# EAGLE design ICS40300-preamp-surfacemount_Rev-B (EAGLE 8.1.0)
COMPANY: ADAFRUIT INDUSTRIES; DRAWN: KTOWN; REV: A
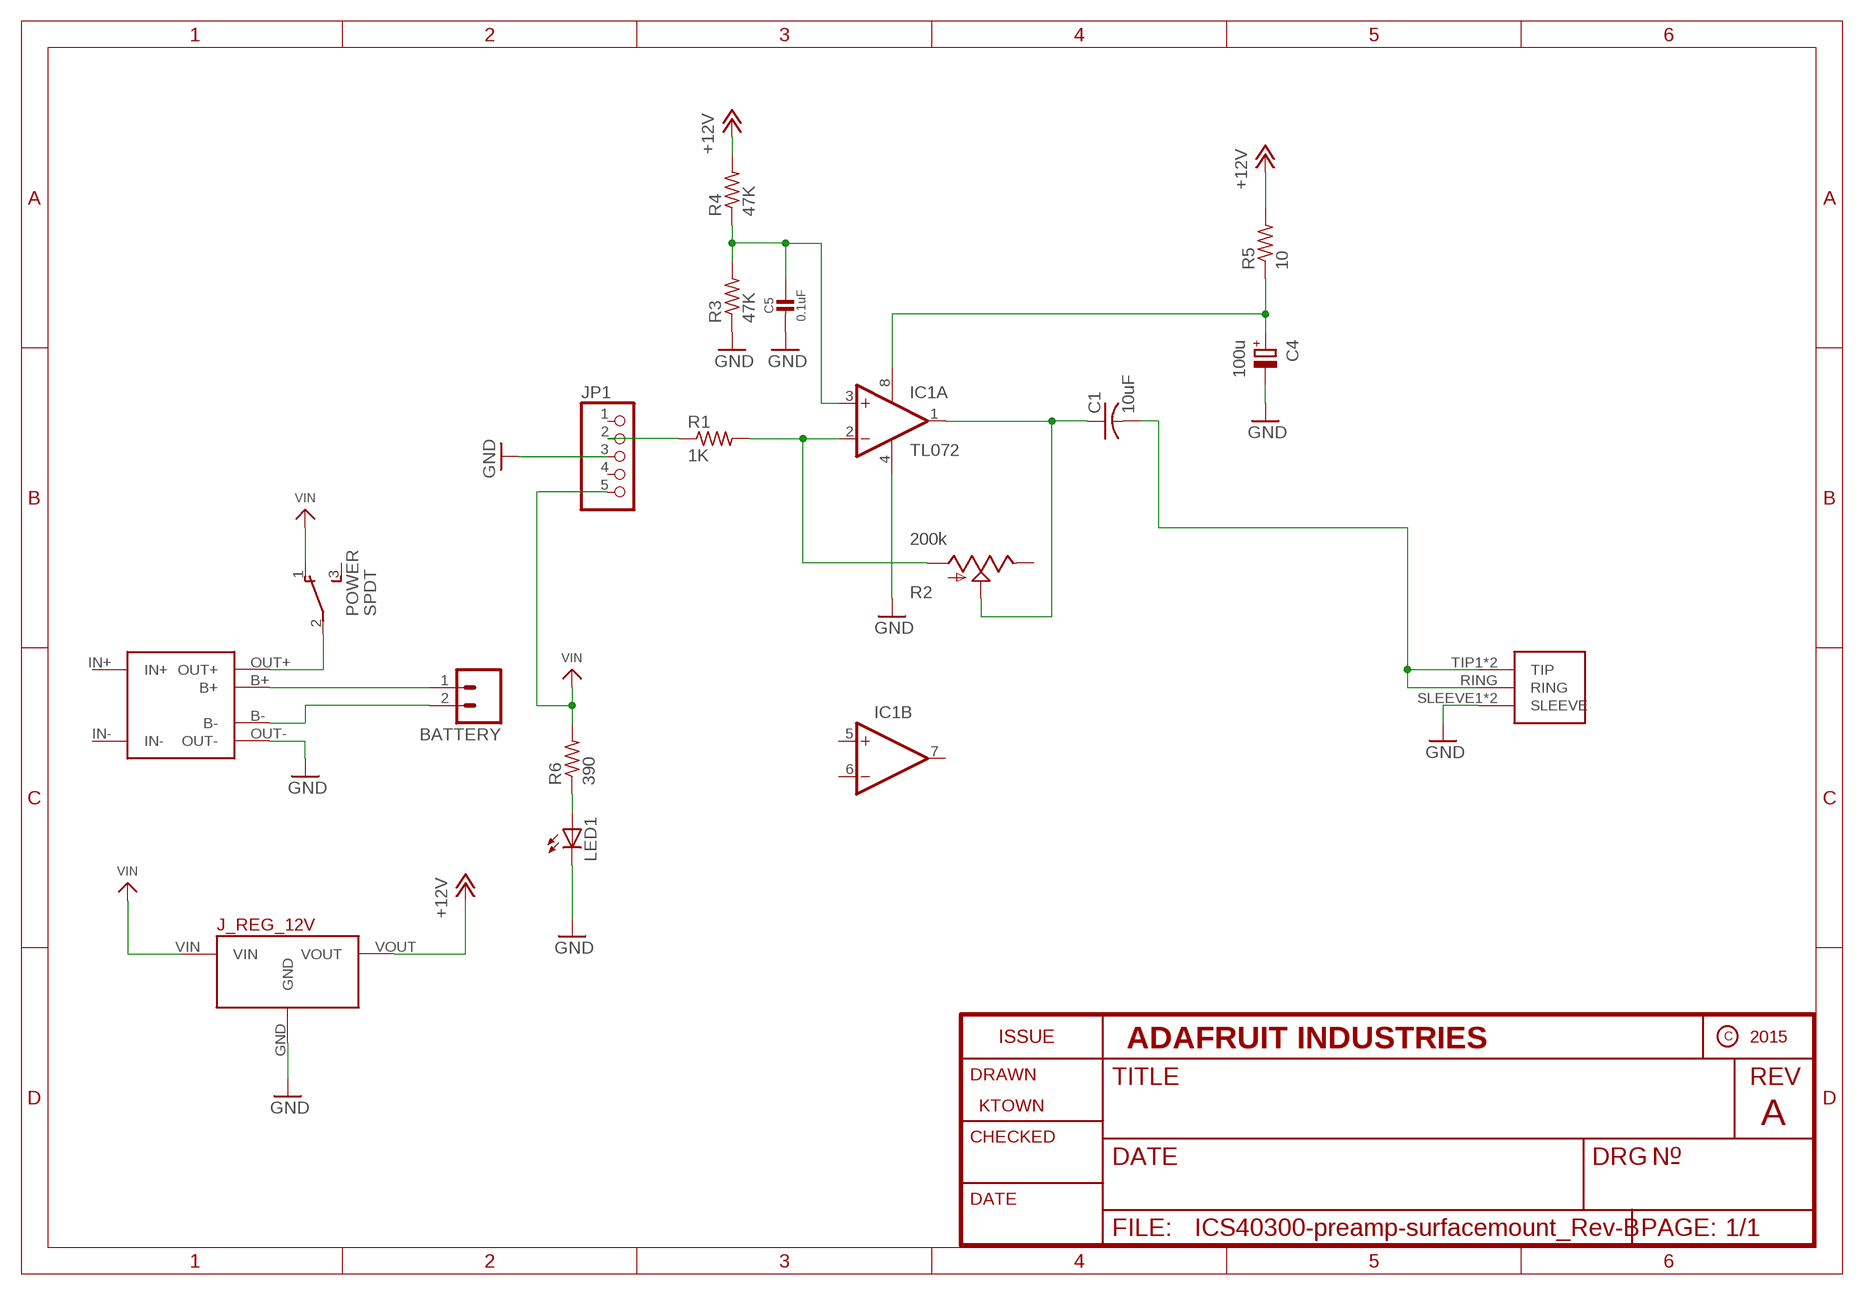
[diagram p0: schematic, sheet 1]

## Parts
BATTERY  M02LOCK  [1X02_LOCK]
C1  10uF  C-USC0805K  [C0805K]
C4  100u  CPOL-EUTT2D4L  [TT2D4L]
C5  0.1uF  CAP_CERAMIC0805-NOOUTLINE  [0805-NO]
IC1  TL072  OPA2134UA  [SO08]
J_REG_12V  POLOLU_VOLTAGE_REGULATORS_3PIN  [POLOLU_5V-12V_STEPUP_U3V12F5-U3V12F12]
JP1  HEADER-1X576MIL  [1X05_ROUND_76]
LED1  LED3MM  [LED3MM]
POWER  SPDT  SWITCH_SPDTTE-CONNECT  [SWITCH_SPDT-TE-CONNECT]
R1  1K  R-US_R0805  [R0805]
R2  200k  TRIMPOT-BOURNS3306W  [TRIMPOT-BOURNS-3306W]
R3  47K  R-US_R0805  [R0805]
R4  47K  R-US_R0805  [R0805]
R5  10  R-US_R0805  [R0805]
R6  390  R-US_R0805  [R0805]
U$1  TP4056-MODULETP4056  [TP4056-LITHIUM-PROTECTED-MODULE-MOVED-PAD]
U$13  1/8"-F-STEREO-PCB  [1/8"-F-STEREO-PCB]

## Nets
+12V: J_REG_12V.VOUT R4.2 R5.2
GND: C4.- C5.2 IC1.4(A:V-) J_REG_12V.GND JP1.3 LED1.K(C) R3.1 U$1.OUT- U$13.SLEEVE1(SLEEVE) U$13.SLEEVE2(SLEEVE)
N$1: JP1.2 R1.1
N$2: IC1.2(A:-IN) R1.2 R2.P$1(IN)
N$3: POWER.2 U$1.OUT+
N$4: C4.+ IC1.8(A:V+) R5.1
N$5: BATTERY.1 U$1.B+
N$6: BATTERY.2 U$1.B-
N$7: C1.2 U$13.RING U$13.TIP1(TIP) U$13.TIP2(TIP)
N$8: C5.1 IC1.3(A:+IN) R3.2 R4.1
N$9: C1.1 IC1.1(A:OUT) R2.P$2(WIPER)
N$16: LED1.A R6.1
VIN: J_REG_12V.VIN JP1.5 POWER.1 R6.2
Unconnected: IC1.5(B:+IN) IC1.6(B:-IN) IC1.7(B:OUT) JP1.1 JP1.4 POWER.3 R2.P$3(OUT)

## Power pins joined to a net without a drawn wire
IN+: U$1.IN+
IN-: U$1.IN-

## Library data of the parts
BATTERY = CMU-ArtFab:M02: Header 2 Standard 2-pin 0.1" header. Use with straight break away headers (SKU : PRT-00116), right angle break away headers (PRT-00553), swiss pins (PRT-00743), machine pins (PRT-00117), and female headers (PRT-00115). Molex polarized connector foot print use with SKU : PRT-08233 with associated crimp pins and housings.
C1 = rcl:C-US: CAPACITOR, American symbol
C4 = rcl:CPOL-EU: POLARIZED CAPACITOR, European symbol
C5 = microbuilder:CAP_CERAMIC: Ceramic Capacitors For new designs, use the packages preceded by an '_' character since they are more reliable: The following footprints should be used on most boards: _0402 - Standard footprint for regular board layouts _0603 - Standard footprint for regular board layouts _0805 - Standard footprint for regular board layouts _1206 - Standard footprint for regular board layouts For extremely tight-pitch boards where space is at a premium, the following 'micro-pitch' footprints can be used (smaller pads, no silkscreen outline, etc.): _0402MP - Micro-pitch footprint for very dense/compact boards _0603MP - Micro-pitch footprint for very dense/compact boards _0805MP - Micro-pitch footprint for very dense/compact boards _1206MP - Micro-pitch footprint for very dense/compact boards
IC1 = linear:OPA2*: Dual Operational Amplifier Low Power, Single-Supply, Rail-To-Rail Operational Amplifier Source: http://focus.ti.com/lit/ds/symlink/opa2345.pdf http://focus.ti.com .. opa241.pdf http://focus.ti.com/lit/ds/symlink/opa2134.pdf; IC_NAME: TL072
J_REG_12V = CMU-ArtFab:POLOLU_VOLTAGE_REGULATORS_3PIN: Polulu 5V Step-Up/Step-Down Voltage REgulator S7V7F5
JP1 = microbuilder:HEADER-1X5: PIN HEADER
LED1 = led:LED: LED OSRAM: - CHIPLED LG R971, LG N971, LY N971, LG Q971, LY Q971, LO R971, LY R971 LH N974, LH R974 LS Q976, LO Q976, LY Q976 LO Q996 - Hyper CHIPLED LW Q18S LB Q993, LB Q99A, LB R99A - SideLED LS A670, LO A670, LY A670, LG A670, LP A670 LB A673, LV A673, LT A673, LW A673 LH A674 LY A675 LS A676, LA A676, LO A676, LY A676, LW A676 LS A679, LY A679, LG A679 - Hyper Micro SIDELED® LS Y876, LA Y876, LO Y876, LY Y876 LT Y87S - SmartLED LW L88C, LW L88S LB L89C, LB L89S, LG L890 LS L89K, LO L89K, LY L89K LS L896, LA L896, LO L896, LY L896 - TOPLED LS T670, LO T670, LY T670, LG T670, LP T670 LSG T670, LSP T670, LSY T670, LOP T670, LYG T670 LG T671, LOG T671, LSG T671 LB T673, LV T673, LT T673, LW T673 LH T674 LS T676, LA T676, LO T676, LY T676, LB T676, LH T676, LSB T676, LW T676 LB T67C, LV T67C, LT T67C, LS T67K, LO T67K, LY T67K, LW E67C LS E67B, LA E67B, LO E67B, LY E67B, LB E67C, LV E67C, LT E67C LW T67C LS T679, LY T679, LG T679 LS T770, LO T770, LY T770, LG T770, LP T770 LB T773, LV T773, LT T773, LW T773 LH T774 LS E675, LA E675, LY E675, LS T675 LS T776, LA T776, LO T776, LY T776, LB T776 LHGB T686 LT T68C, LB T68C - Hyper Mini TOPLED® LB M676 - Mini TOPLED Santana® LG M470 LS M47K, LO M47K, LY M47K Source: http://www.osram.convergy.de LUXEON: - LUMILED® LXK2-PW12-R00, LXK2-PW12-S00, LXK2-PW14-U00, LXK2-PW14-V00 LXK2-PM12-R00, LXK2-PM12-S00, LXK2-PM14-U00 LXK2-PE12-Q00, LXK2-PE12-R00, LXK2-PE12-S00, LXK2-PE14-T00, LXK2-PE14-U00 LXK2-PB12-K00, LXK2-PB12-L00, LXK2-PB12-M00, LXK2-PB14-N00, LXK2-PB14-P00, LXK2-PB14-Q00 LXK2-PR12-L00, LXK2-PR12-M00, LXK2-PR14-Q00, LXK2-PR14-R00 LXK2-PD12-Q00, LXK2-PD12-R00, LXK2-PD12-S00 LXK2-PH12-R00, LXK2-PH12-S00 LXK2-PL12-P00, LXK2-PL12-Q00, LXK2-PL12-R00 Source: www.luxeon.com KINGBRIGHT: KA-3528ASYC Source: www.kingbright.com
POWER = CMU-ArtFab:SWITCH_SPDT
R1 R3-R6 = CMU-ArtFab:R-US_: RESISTOR, American symbol
R2 = CMU-ArtFab:TRIMPOT-BOURNS
U$1 = CMU-ArtFab:TP4056-MODULE
U$13 = CMU-ArtFab:1/8"-F-STEREO-PCB

## Board
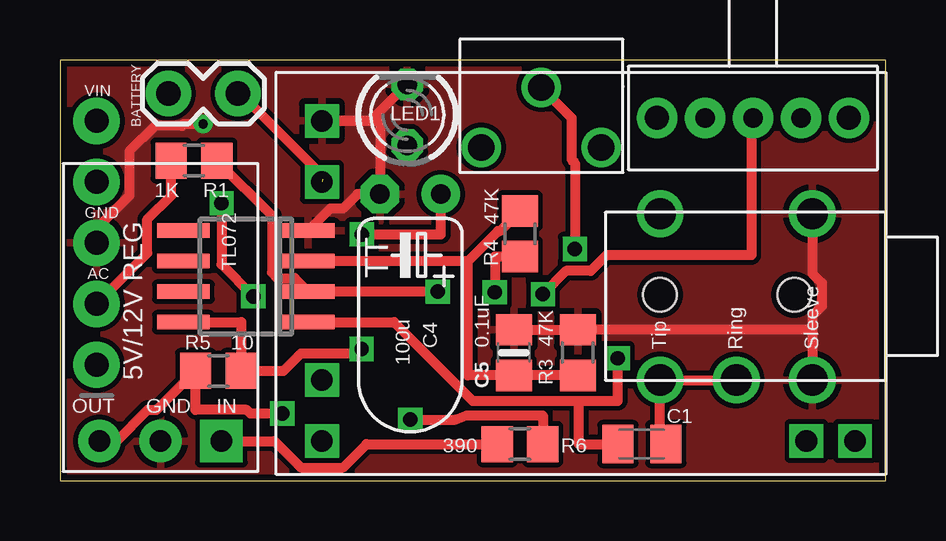
[diagram p1: board, top side]
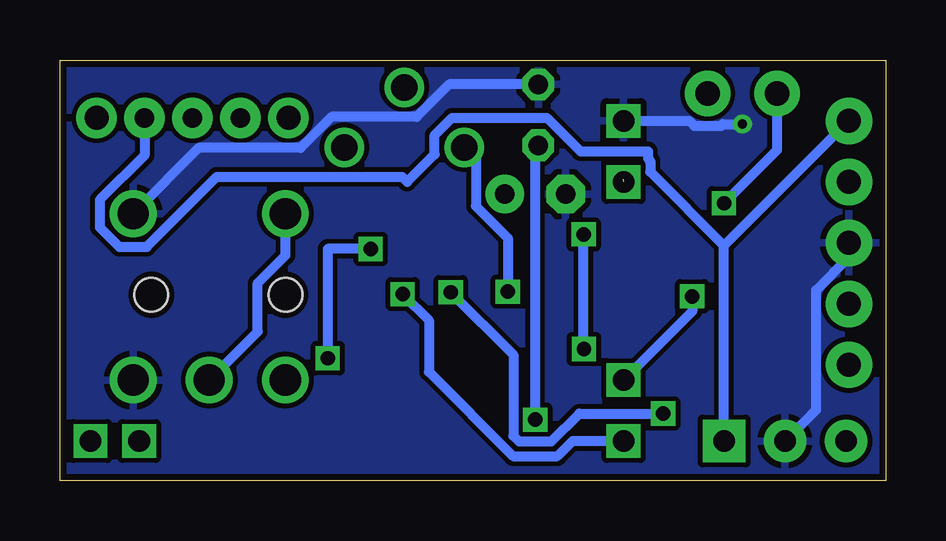
[diagram p2: board, bottom side, seen from below]

Size 34.42 x 17.53 mm. Coordinates in mm from the lower left corner, seen from the top.
Outline: 0,0 34.42,0 34.42,17.53 0,17.53 0,0
Copper layers (1*16): Top 0.035mm / dielectric 1.5mm / Bottom 0.035mm
Design rules "adafruit *": minimum track width 12mil, minimum drill 15.5mil, track to track 8mil, track to pad 8mil, pad to pad 8mil, via to via 8mil, smd to smd 8mil, copper to edge 10mil, drill to drill 8mil, minimum pad ring 10mil, minimum via ring 8mil, stop-mask expansion 2mil, vias tented up to drill 20mil, thermal gap 10mil

### Footprints (pad centres in the part's own frame; a part is rotated, then mirrored left to right if it is on the bottom)
1X02_LOCK = drill 1.016 pad 1.88: 1 -0.178,0; 2 2.718,0
C0805K = smd 1.3 x 1.6: 1 -1,0; 2 1,0
TT2D4L = drill 0.813 pad 1.6: + -1.27,0 | drill 0.813 pad 1.6 octagon: - 1.27,0
0805-NO = smd 1.3 x 1.5: 1 -0.95,0; 2 0.95,0
SO08 = smd 0.6 x 2.2: 1 -1.905,-2.6; 2 -0.635,-2.6; 3 0.635,-2.6; 4 1.905,-2.6; 5 1.905,2.6; 6 0.635,2.6; 7 -0.635,2.6; 8 -1.905,2.6
POLOLU_5V-12V_STEPUP_U3V12F5-U3V12F12 = drill 0.9 pad 1.778: GND 0,-6.35; VOUT -2.54,-6.35 | drill 0.9 pad 1.778 square: VIN 2.54,-6.35
1X05_ROUND_76 = drill 1 pad 1.93: 1 -5.08,0; 2 -2.54,0; 3 0,0; 4 2.54,0; 5 5.08,0
LED3MM = drill 0.813 octagon: A -1.27,0; K 1.27,0
SWITCH_SPDT-TE-CONNECT = drill 0.8 pad 1.676: 1 2,0; 2 4,0; 3 6,0 | drill 1 pad 1.676: MOUNT1 0,0; MOUNT2 8,0
R0805 = smd 1.3 x 1.5: 1 -0.95,0; 2 0.95,0
TRIMPOT-BOURNS-3306W = drill 1.1: P$1 -2.505,-2.495; P$2 -0.005,0.005; P$3 2.495,-2.495
TP4056-LITHIUM-PROTECTED-MODULE-MOVED-PAD = drill 0.9 square: B+ 10.795,4.445; B- 10.795,-3.81; IN+ -11.43,6.985; IN- -9.398,6.985; OUT+ 10.795,6.985; OUT- 10.795,-6.35
1/8"-F-STEREO-PCB = drill 1.3: RING 5.461,0; SLEEVE1 8.636,6.934; SLEEVE2 8.636,0; TIP1 2.286,6.934; TIP2 2.286,0 | hole 1.4: 2.286,3.556; 7.874,3.556

### Placement (x,y rotation side)
BATTERY  4.7,16.13 0 top
C1  24.26,1.52 0 top
C4  14.61,11.94 180 top
C5  18.92,5.33 90 top
IC1  7.75,8.51 90 top
J_REG_12V  4.19,8 0 top
JP1  1.52,9.91 90 top
LED1  14.48,15.24 90 top
POWER  32.89,15.11 180 top
R1  5.59,13.34 0 top
R2  20.07,16.38 0 top
R3  21.59,5.33 270 top
R4  19.18,10.29 270 top
R5  6.6,4.57 180 top
R6  19.18,1.52 180 top
U$1  21.72,8.64 180 top
U$13  22.73,4.19 0 top

### Tracks (layer width: path | path; a pad name or v marks a point on that pad's centre or on a via)
+12V  (via drill 0.6)
  Top 0.406: J_REG_12V.VOUT 2.36,1.65 3.65,2.95 4.03,2.95 R5.2 5.65,2.95 7.79,2.95 7.94,2.79 v9.27,2.79 | R4.2 18.13,9.34 v18.13,7.85
  Bottom 0.406: v18.13,7.85 15.52,5.24 15.52,1.87 15.28,1.63 13.93,1.63 12.77,2.79 v9.27,2.79
GND  (via drill 0.38)
  Top 0.406: C5.2 R3.1 31.37,6.28 | 31.37,6.28 U$13.SLEEVE2 | U$13.SLEEVE1 31.37,8.62 31.76,8.23 31.76,7.27 31.37,6.87 31.37,6.28 | LED1.K 12.95,14.99 U$1.OUT- 13.34,14.99 C4.- 12.4,11.94 11.79,11.34 11.27,11.34 IC1.4 | v5.97,14.86 5.16,14.86 5.08,14.78 3.96,14.78 2.9,13.71 2.9,11.88 1.52,10.51 JP1.3
  Bottom 0.406: JP1.3 1.52,9.31 2.9,7.93 2.9,2.95 J_REG_12V.GND | LED1.K 18.2,16.51 19.55,15.16 23.09,15.16 24.38,13.87 28.63,13.87 U$13.SLEEVE1 | U$1.OUT- 8.18,14.99 7.97,14.78 6.86,14.78 6.78,14.86 v5.97,14.86
  pour Top: 34.8,-0.76 34.8,18.29 -0.25,18.29 -0.25,-0.76
  pour Bottom: -0.25,-0.76 34.8,-0.76 34.8,18.29 -0.25,18.29
N$1
  Top 0.406: R1.1 4.64,11.88 3.64,10.88 3.64,9.48 JP1.2
N$2  (via drill 0.6)
  Top 0.406: R1.2 8.84,11.03 8.84,8.68 9.08,8.44 9.78,8.44 IC1.2 v15.75,7.87
  Bottom 0.406: v15.75,7.87 15.75,10.11 17.08,11.44 17.08,13.41 R2.P$1
N$3  (via drill 0.6)
  Top 0.406: POWER.2 28.83,15.11 28.83,9.4 22.79,9.4 22.14,8.74 21.1,8.74 v20.13,7.77
  Bottom 0.406: v20.13,7.77 19.04,6.68 19.04,4.53 15.53,1.02 13.68,1.02 13.05,1.65 U$1.OUT+
N$4  (via drill 0.6)
  Top 0.406: v12.57,5.49 12.39,5.3 10.05,5.3 9.32,4.57 R5.1 7.55,6.6 IC1.8 | v12.59,10.26 15.88,10.26 C4.+
  Bottom 0.406: v12.57,5.49 12.59,5.49 v12.59,10.26
N$5  (via drill 0.6)
  Top 0.406: v6.73,11.56 6.73,9.01 v8.06,7.68
  Bottom 0.406: BATTERY.1 4.52,13.77 v6.73,11.56 | v8.06,7.68 8.06,7.05 U$1.B+
N$6  (1 unrouted)
  Top 0.406: 10.96,12.55 10.96,12.7 7.53,16.13 BATTERY.2
N$7
  Top 0.406: U$13.RING U$13.TIP2 25.02,1.52 C1.2
  Bottom 0.406: U$13.TIP1 25.02,9.38 26.18,8.23 26.18,6.21 U$13.RING
N$8
  Top 0.406: 17.01,9.14 IC1.3 | R4.1 18.33,10.39 18.26,10.39 17.01,9.14 | R3.2 C5.1 17.01,4.38 17.01,9.14
N$9  (via drill 0.6)
  Top 0.406: IC1.1 13.93,6.6 17.2,3.33 21.63,3.33 | v21.46,9.65 21.46,13.24 21.33,13.38 21.33,15.12 R2.P$2 | 23.43,5.1 v23.25,5.1 23.25,3.33 21.63,3.33 | C1.1 21.63,1.52 21.63,3.33
  Bottom 0.406: v21.46,9.65 23.25,9.65 v23.25,5.1
N$16  (via drill 0.6)
  Top 0.406: v14.61,2.54 16.49,2.54 16.95,2.72 20.13,2.72 R6.1
  Bottom 0.406: LED1.A 14.61,13.97 v14.61,2.54
VIN
  Top 0.406: J_REG_12V.VIN 8.94,1.65 10.05,0.54 11.79,0.54 12.78,1.52 R6.2
  Bottom 0.406: 6.73,9.78 JP1.5 | J_REG_12V.VIN 6.73,9.78 | POWER.1 30.89,13.55 32.75,11.7 32.75,10.55 31.94,9.74 30.8,9.74 27.88,12.66 20.15,12.66 19.94,12.45 18.79,13.59 18.79,14.4 18.07,15.12 14.12,15.12 12.71,13.72 9.91,13.72 9.91,13.41 9.81,13.32 9.81,12.86 6.73,9.78

### Text on the board
tNames: VIN | GND | AC